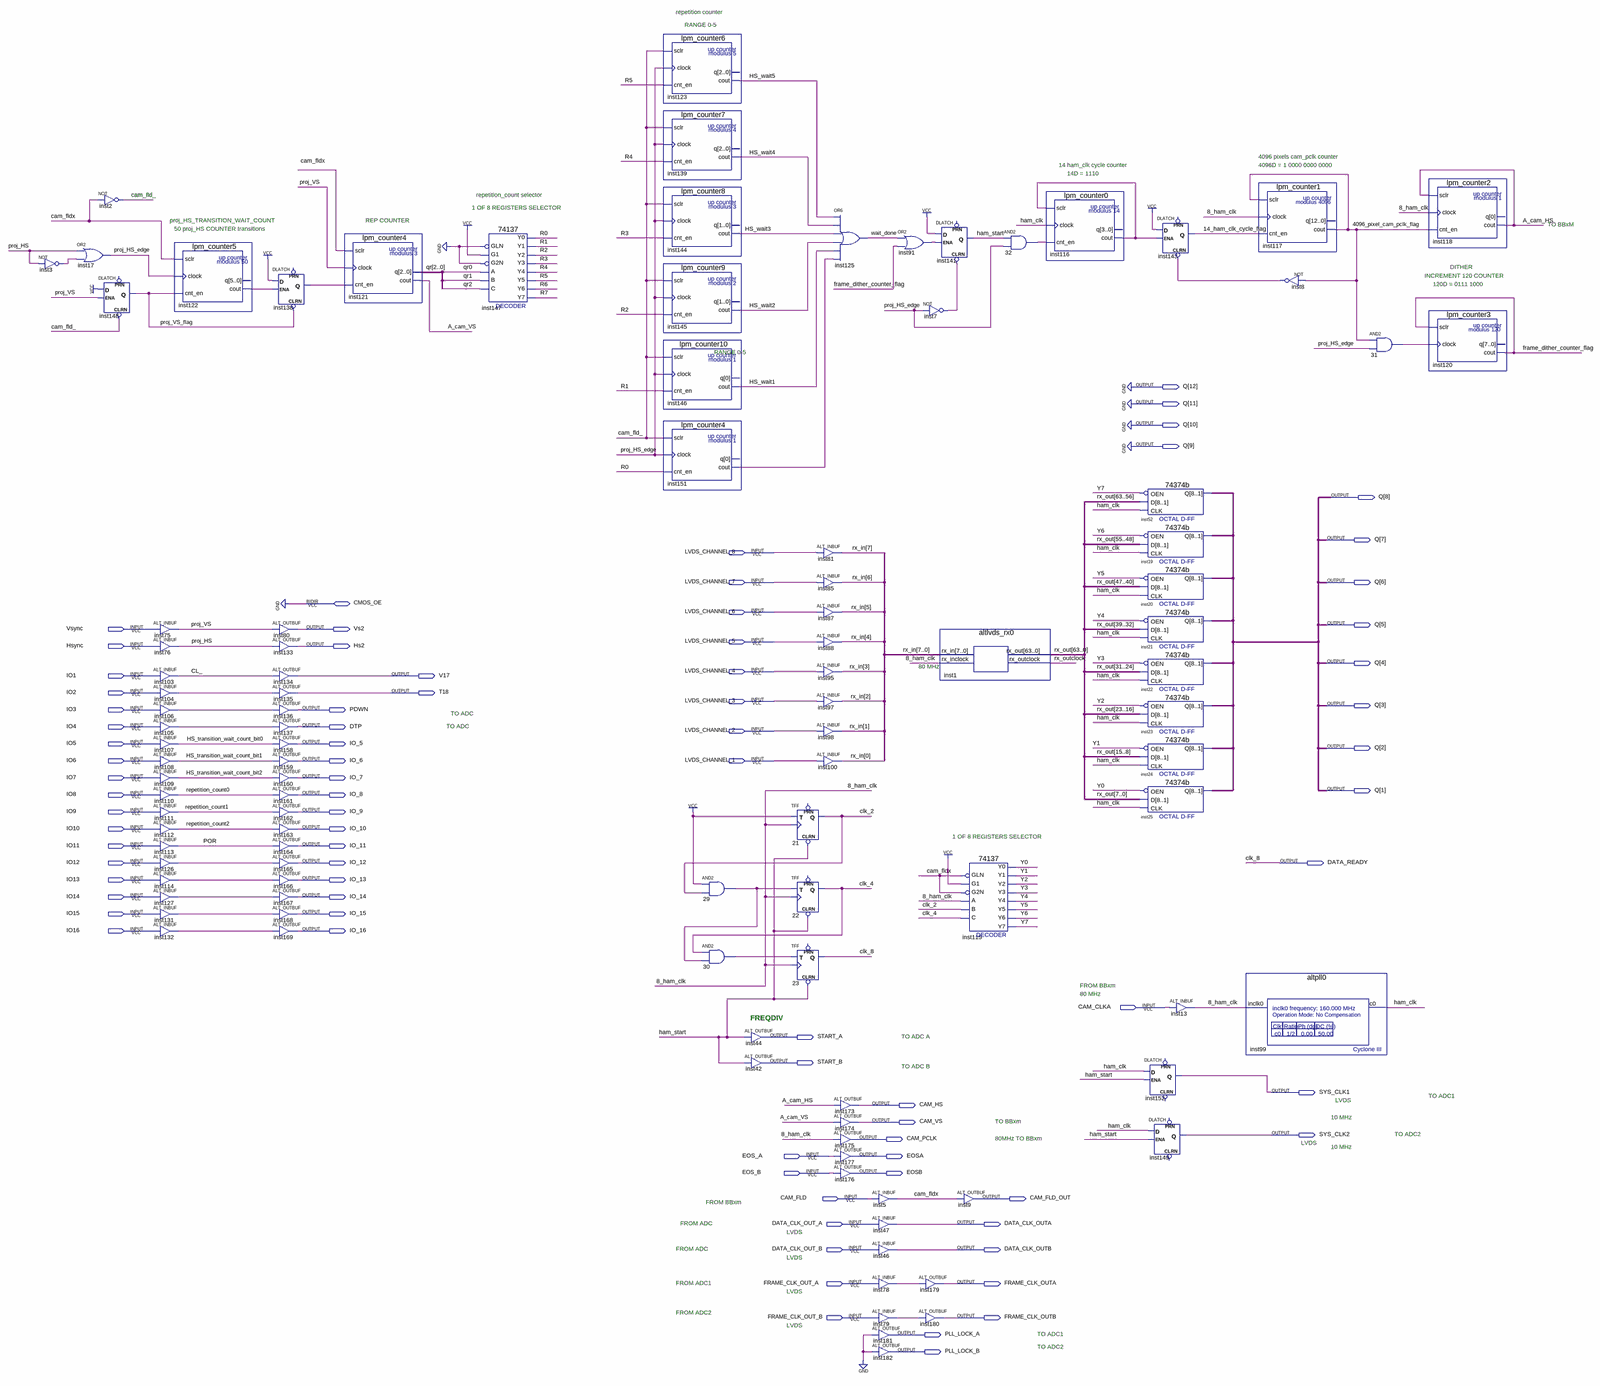
[diagram p0: schematic sheet, whole]
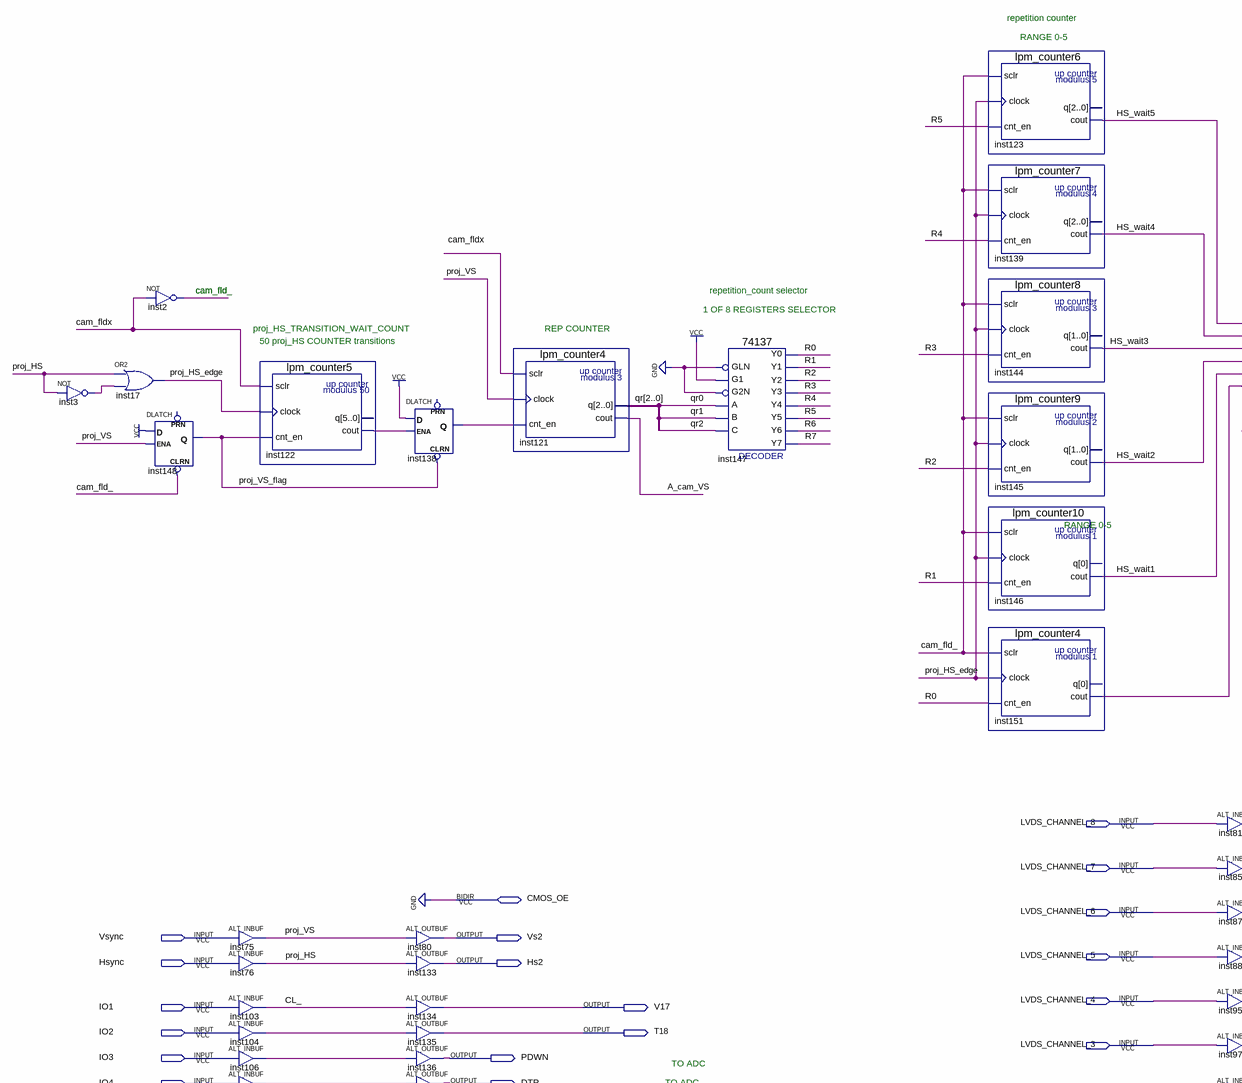
[diagram p1: schematic sheet, upper left part]
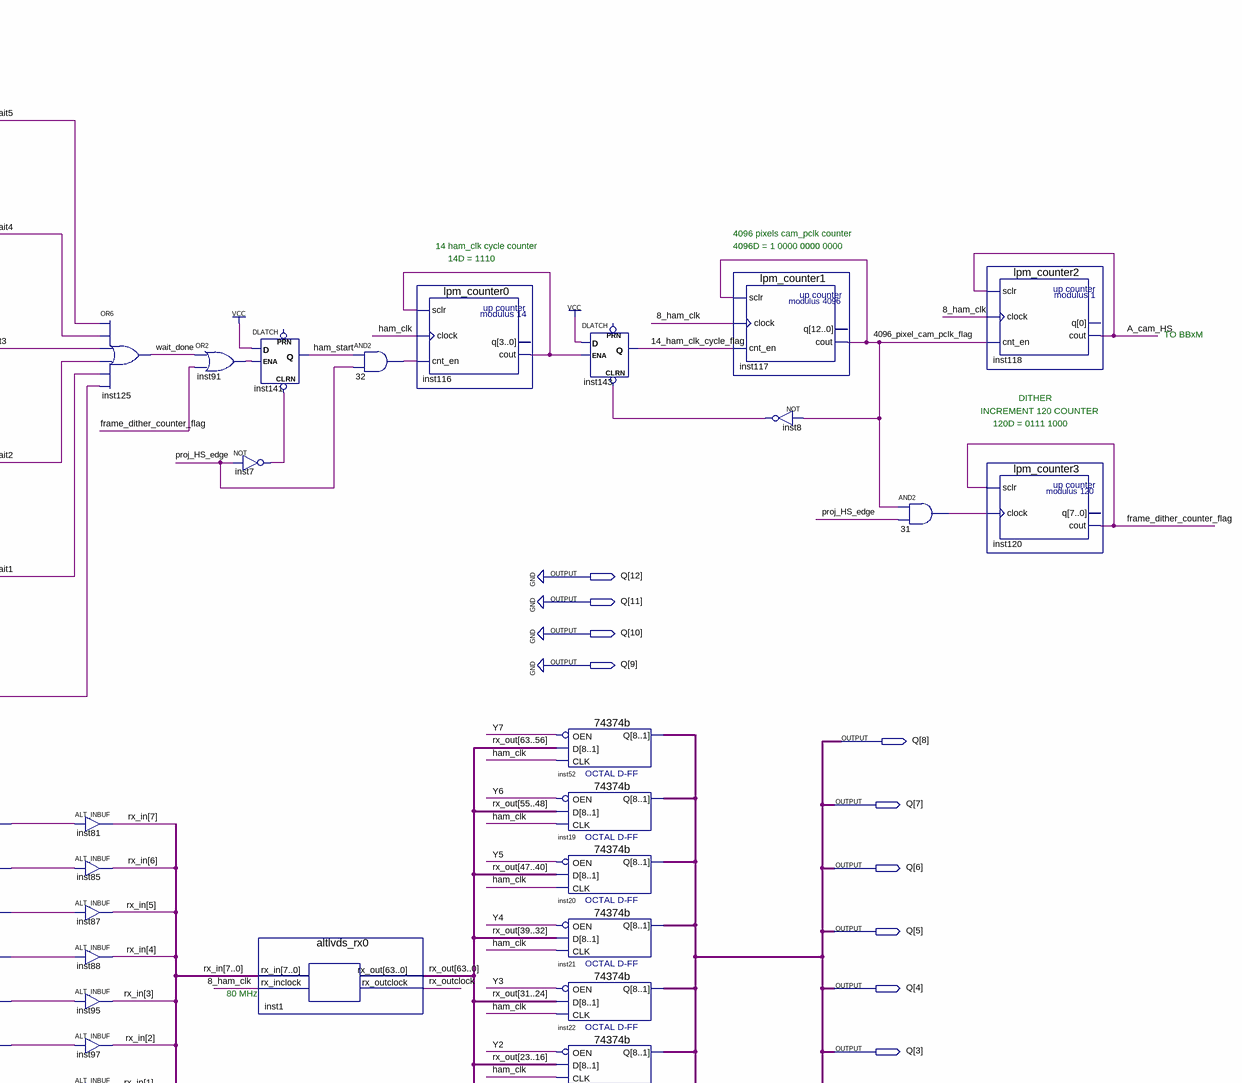
[diagram p2: schematic sheet, upper right part]
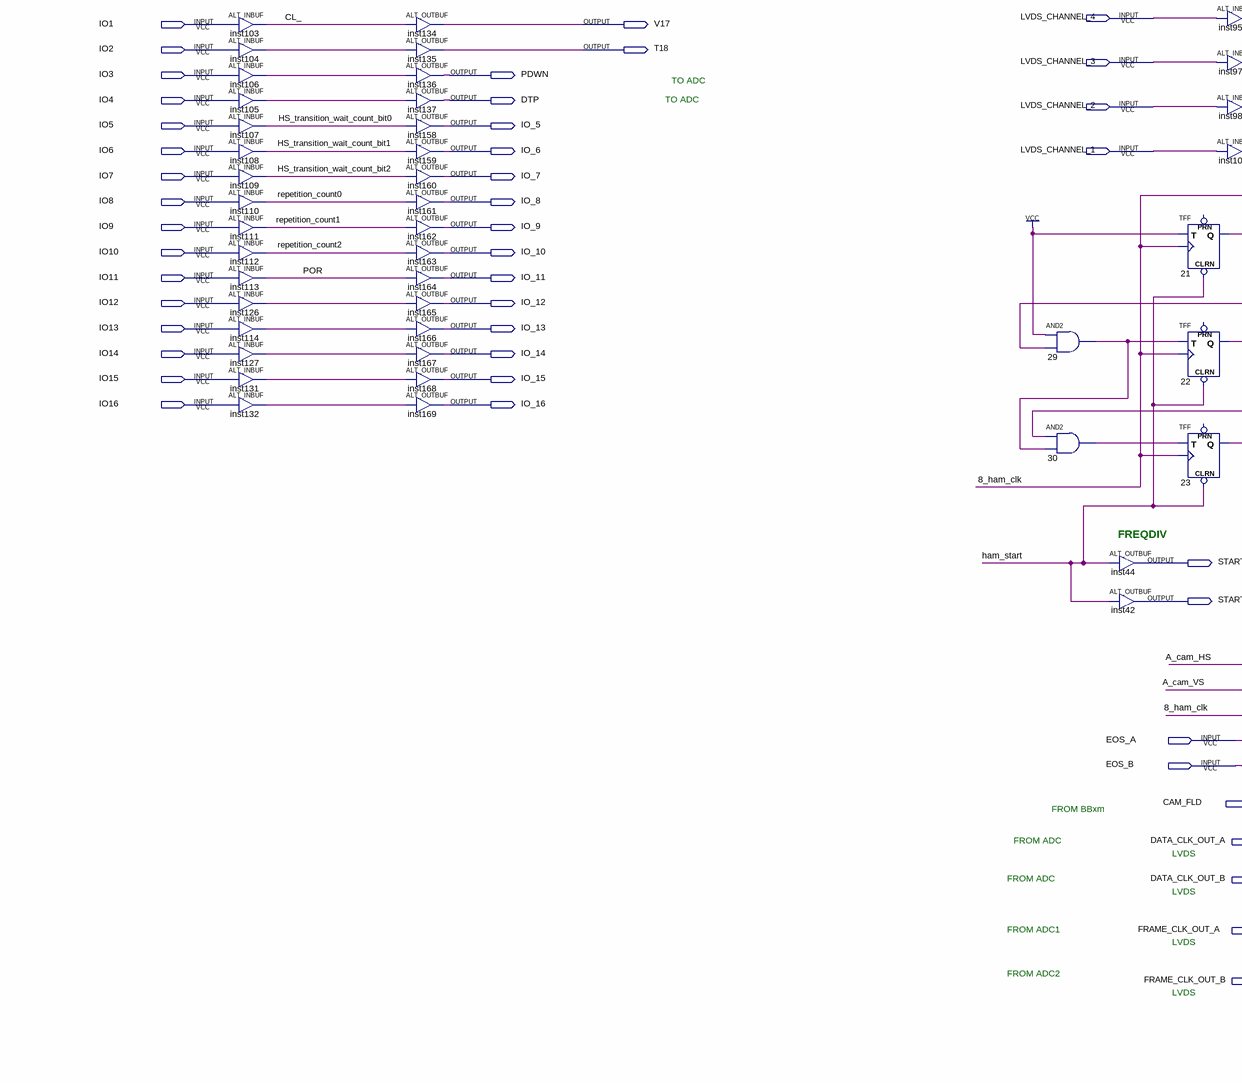
[diagram p3: schematic sheet, lower left part]
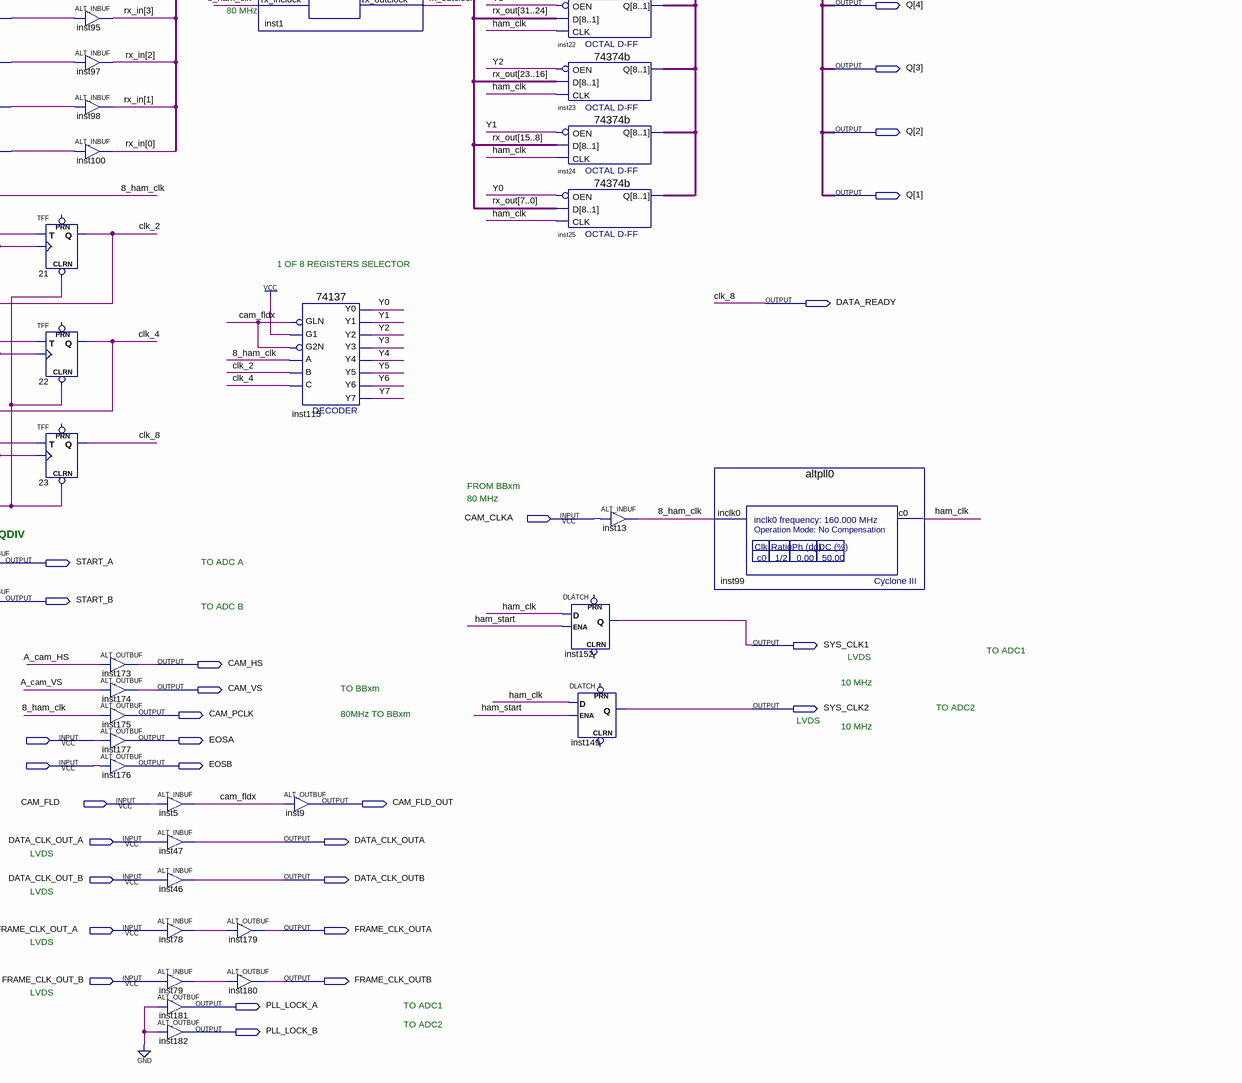
[diagram p4: schematic sheet, lower right part]
// Quartus schematic M2FS-Data-Formatter.bdf as structural Verilog: 106 symbols, 82 pins
module \M2FS-Data-Formatter  (
  input  LVDS_CHANNEL_8,
  input  LVDS_CHANNEL_7,
  input  LVDS_CHANNEL_6,
  input  Vsync,
  input  LVDS_CHANNEL_5,
  input  Hsync,
  input  LVDS_CHANNEL_4,
  input  IO1,
  input  IO2,
  input  LVDS_CHANNEL_3,
  input  IO3,
  input  IO4,
  input  LVDS_CHANNEL_2,
  input  IO5,
  input  IO6,
  input  LVDS_CHANNEL_1,
  input  IO7,
  input  IO8,
  input  IO9,
  input  IO10,
  input  IO11,
  input  IO12,
  input  IO13,
  input  IO14,
  input  IO15,
  input  IO16,
  input  CAM_CLKA,
  input  EOS_A,
  input  EOS_B,
  input  CAM_FLD,
  input  DATA_CLK_OUT_A,
  input  DATA_CLK_OUT_B,
  input  FRAME_CLK_OUT_A,
  input  FRAME_CLK_OUT_B,
  inout  CMOS_OE,
  output [12:1] Q,
  output Vs2,
  output Hs2,
  output V17,
  output T18,
  output PDWN,
  output DTP,
  output IO_5,
  output IO_6,
  output IO_7,
  output IO_8,
  output IO_9,
  output IO_10,
  output IO_11,
  output IO_12,
  output DATA_READY,
  output IO_13,
  output IO_14,
  output IO_15,
  output IO_16,
  output START_A,
  output START_B,
  output SYS_CLK1,
  output CAM_HS,
  output CAM_VS,
  output SYS_CLK2,
  output CAM_PCLK,
  output EOSA,
  output EOSB,
  output CAM_FLD_OUT,
  output DATA_CLK_OUTA,
  output DATA_CLK_OUTB,
  output FRAME_CLK_OUTA,
  output FRAME_CLK_OUTB,
  output PLL_LOCK_A,
  output PLL_LOCK_B
);

  wire \8_ham_clk , \14_ham_clk_cycle_flag , \4096_pixel_cam_pclk_flag , A_cam_HS, A_cam_VS, cam_fld_,
       cam_fldx, CL_, clk_2, clk_4, frame_dither_counter_flag, ham_clk, ham_start,
       HS_transition_wait_count_bit0, HS_transition_wait_count_bit1, HS_transition_wait_count_bit2, HS_wait1,
       HS_wait2, HS_wait3, HS_wait4, HS_wait5, inst3_out, inst7_out, inst8_out, inst78_o, inst79_o,
       inst91_out, inst104_o, inst105_o, inst106_o, inst114_o, inst116_cout, inst122_cout, inst126_o,
       inst127_o, inst131_o, inst132_o, inst138_q, inst151_cout, n29_out, n30_out, n31_out, n32_out, POR,
       proj_HS, proj_HS_edge, proj_VS, proj_VS_flag, R0, R1, R2, R3, R4, R5, R6, R7, repetition_count0,
       repetition_count1, repetition_count2, rx_outclock, wait_done, Y0, Y1, Y2, Y3, Y4, Y5, Y6, Y7;
  wire [2:0] qr;
  wire [7:0] inst52_q, rx_in;
  wire [63:0] rx_out;

  not inst3 (inst3_out, proj_HS);
  or inst17 (proj_HS_edge, proj_HS, inst3_out);
  not inst2 (cam_fld_, cam_fldx);
  DLATCH inst148 (.CLRN(cam_fld_), .D(1'b1), .ENA(proj_VS), .Q(proj_VS_flag));  // open: PRN
  lpm_counter5 inst122 (.sclr(cam_fldx), .clock(proj_HS_edge), .cnt_en(proj_VS_flag), .cout(inst122_cout));  // open: q
  ALT_INBUF inst75 (.i(Vsync), .o(proj_VS));
  ALT_INBUF inst76 (.i(Hsync), .o(proj_HS));
  ALT_INBUF inst103 (.i(IO1), .o(CL_));
  ALT_INBUF inst104 (.i(IO2), .o(inst104_o));
  ALT_INBUF inst106 (.i(IO3), .o(inst106_o));
  ALT_INBUF inst105 (.i(IO4), .o(inst105_o));
  ALT_INBUF inst107 (.i(IO5), .o(HS_transition_wait_count_bit0));
  ALT_INBUF inst108 (.i(IO6), .o(HS_transition_wait_count_bit1));
  ALT_INBUF inst109 (.i(IO7), .o(HS_transition_wait_count_bit2));
  ALT_INBUF inst110 (.i(IO8), .o(repetition_count0));
  ALT_INBUF inst111 (.i(IO9), .o(repetition_count1));
  ALT_INBUF inst112 (.i(IO10), .o(repetition_count2));
  ALT_INBUF inst113 (.i(IO11), .o(POR));
  ALT_INBUF inst126 (.i(IO12), .o(inst126_o));
  ALT_INBUF inst114 (.i(IO13), .o(inst114_o));
  ALT_INBUF inst127 (.i(IO14), .o(inst127_o));
  ALT_INBUF inst131 (.i(IO15), .o(inst131_o));
  ALT_INBUF inst132 (.i(IO16), .o(inst132_o));
  DLATCH inst138 (.CLRN(proj_VS_flag), .D(1'b1), .ENA(inst122_cout), .Q(inst138_q));  // open: PRN
  ALT_OUTBUF inst80 (.i(proj_VS), .o(Vs2));
  ALT_OUTBUF inst133 (.i(proj_HS), .o(Hs2));
  ALT_OUTBUF inst134 (.i(CL_), .o(V17));
  ALT_OUTBUF inst135 (.i(inst104_o), .o(T18));
  ALT_OUTBUF inst136 (.i(inst106_o), .o(PDWN));
  ALT_OUTBUF inst137 (.i(inst105_o), .o(DTP));
  ALT_OUTBUF inst158 (.i(HS_transition_wait_count_bit0), .o(IO_5));
  ALT_OUTBUF inst159 (.i(HS_transition_wait_count_bit1), .o(IO_6));
  ALT_OUTBUF inst160 (.i(HS_transition_wait_count_bit2), .o(IO_7));
  ALT_OUTBUF inst161 (.i(repetition_count0), .o(IO_8));
  ALT_OUTBUF inst162 (.i(repetition_count1), .o(IO_9));
  ALT_OUTBUF inst163 (.i(repetition_count2), .o(IO_10));
  ALT_OUTBUF inst164 (.i(POR), .o(IO_11));
  ALT_OUTBUF inst165 (.i(inst126_o), .o(IO_12));
  ALT_OUTBUF inst166 (.i(inst114_o), .o(IO_13));
  ALT_OUTBUF inst167 (.i(inst127_o), .o(IO_14));
  ALT_OUTBUF inst168 (.i(inst131_o), .o(IO_15));
  ALT_OUTBUF inst169 (.i(inst132_o), .o(IO_16));
  lpm_counter4 inst121 (.sclr(cam_fldx), .clock(proj_VS), .cnt_en(inst138_q), .cout(A_cam_VS), .q(qr));
  \74137  inst147 (
    .GLN(1'b0), .G1(1'b1), .A(qr[0]), .G2N(1'b0), .B(qr[1]), .C(qr[2]), .Y0(R0), .Y1(R1), .Y2(R2), .Y5(R5),
    .Y4(R4), .Y3(R3), .Y6(R6), .Y7(R7));
  lpm_counter6 inst123 (.sclr(cam_fld_), .clock(proj_HS_edge), .cnt_en(R5), .cout(HS_wait5));  // open: q
  lpm_counter7 inst139 (.sclr(cam_fld_), .clock(proj_HS_edge), .cnt_en(R4), .cout(HS_wait4));  // open: q
  lpm_counter8 inst144 (.sclr(cam_fld_), .clock(proj_HS_edge), .cnt_en(R3), .cout(HS_wait3));  // open: q
  lpm_counter9 inst145 (.sclr(cam_fld_), .clock(proj_HS_edge), .cnt_en(R2), .cout(HS_wait2));  // open: q
  lpm_counter10 inst146 (.sclr(cam_fld_), .clock(proj_HS_edge), .cnt_en(R1), .cout(HS_wait1));  // open: q
  lpm_counter4 inst151 (.sclr(cam_fld_), .clock(proj_HS_edge), .cnt_en(R0), .cout(inst151_cout));  // open: q
  and u_29 (n29_out, 1'b1, clk_2);
  and u_30 (n30_out, clk_4, n29_out);
  ALT_OUTBUF inst44 (.i(ham_start), .o(START_A));
  ALT_OUTBUF inst42 (.i(ham_start), .o(START_B));
  TFF u_21 (.CLRN(ham_start), .T(1'b1), .CLK(\8_ham_clk ), .Q(clk_2));  // open: PRN
  TFF u_22 (.CLRN(ham_start), .T(n29_out), .CLK(\8_ham_clk ), .Q(clk_4));  // open: PRN
  TFF u_23 (.CLRN(ham_start), .T(n30_out), .CLK(\8_ham_clk ), .Q(DATA_READY));  // open: PRN
  ALT_INBUF inst81 (.i(LVDS_CHANNEL_8), .o(rx_in[7]));
  ALT_INBUF inst85 (.i(LVDS_CHANNEL_7), .o(rx_in[6]));
  ALT_INBUF inst87 (.i(LVDS_CHANNEL_6), .o(rx_in[5]));
  ALT_INBUF inst88 (.i(LVDS_CHANNEL_5), .o(rx_in[4]));
  ALT_INBUF inst95 (.i(LVDS_CHANNEL_4), .o(rx_in[3]));
  ALT_INBUF inst97 (.i(LVDS_CHANNEL_3), .o(rx_in[2]));
  ALT_INBUF inst98 (.i(LVDS_CHANNEL_2), .o(rx_in[1]));
  ALT_INBUF inst100 (.i(LVDS_CHANNEL_1), .o(rx_in[0]));
  or inst125 (wait_done, HS_wait5, HS_wait4, HS_wait3, HS_wait2, HS_wait1, inst151_cout);
  ALT_OUTBUF inst173 (.i(A_cam_HS), .o(CAM_HS));
  ALT_OUTBUF inst174 (.i(A_cam_VS), .o(CAM_VS));
  ALT_OUTBUF inst175 (.i(\8_ham_clk ), .o(CAM_PCLK));
  ALT_OUTBUF inst177 (.i(EOS_A), .o(EOSA));
  ALT_OUTBUF inst176 (.i(EOS_B), .o(EOSB));
  or inst91 (inst91_out, wait_done, frame_dither_counter_flag);
  ALT_INBUF inst5 (.i(CAM_FLD), .o(cam_fldx));
  ALT_INBUF inst47 (.i(DATA_CLK_OUT_A), .o(DATA_CLK_OUTA));
  ALT_INBUF inst46 (.i(DATA_CLK_OUT_B), .o(DATA_CLK_OUTB));
  ALT_INBUF inst78 (.i(FRAME_CLK_OUT_A), .o(inst78_o));
  ALT_INBUF inst79 (.i(FRAME_CLK_OUT_B), .o(inst79_o));
  ALT_OUTBUF inst181 (.i(1'b0), .o(PLL_LOCK_A));
  ALT_OUTBUF inst182 (.i(1'b0), .o(PLL_LOCK_B));
  not inst7 (inst7_out, proj_HS_edge);
  ALT_OUTBUF inst179 (.i(inst78_o), .o(FRAME_CLK_OUTA));
  ALT_OUTBUF inst180 (.i(inst79_o), .o(FRAME_CLK_OUTB));
  DLATCH inst141 (.CLRN(inst7_out), .D(1'b1), .ENA(inst91_out), .Q(ham_start));  // open: PRN
  altlvds_rx0 inst1 (.rx_in(rx_in), .rx_inclock(\8_ham_clk ), .rx_out(rx_out), .rx_outclock(rx_outclock));
  \74137  inst115 (
    .GLN(cam_fldx), .G1(1'b1), .A(\8_ham_clk ), .G2N(cam_fldx), .B(clk_2), .C(clk_4), .Y0(Y0), .Y1(Y1),
    .Y2(Y2), .Y5(Y5), .Y4(Y4), .Y3(Y3), .Y6(Y6), .Y7(Y7));
  ALT_OUTBUF inst9 (.i(cam_fldx), .o(CAM_FLD_OUT));
  and u_32 (n32_out, ham_start, proj_HS_edge);
  lpm_counter0 inst116 (.sclr(inst116_cout), .clock(ham_clk), .cnt_en(n32_out), .cout(inst116_cout));  // open: q
  DLATCH inst143 (.CLRN(inst8_out), .D(1'b1), .ENA(inst116_cout), .Q(\14_ham_clk_cycle_flag ));  // open: PRN
  \74374b  inst52 (.D(rx_out[63:56]), .OEN(Y7), .CLK(ham_clk), .Q(inst52_q));
  \74374b  inst19 (.D(rx_out[55:48]), .OEN(Y6), .CLK(ham_clk), .Q(inst52_q));
  \74374b  inst20 (.D(rx_out[47:40]), .OEN(Y5), .CLK(ham_clk), .Q(inst52_q));
  \74374b  inst21 (.D(rx_out[39:32]), .OEN(Y4), .CLK(ham_clk), .Q(inst52_q));
  \74374b  inst22 (.D(rx_out[31:24]), .OEN(Y3), .CLK(ham_clk), .Q(inst52_q));
  \74374b  inst23 (.D(rx_out[23:16]), .OEN(Y2), .CLK(ham_clk), .Q(inst52_q));
  \74374b  inst24 (.D(rx_out[15:8]), .OEN(Y1), .CLK(ham_clk), .Q(inst52_q));
  \74374b  inst25 (.D(rx_out[7:0]), .OEN(Y0), .CLK(ham_clk), .Q(inst52_q));
  ALT_INBUF inst13 (.i(CAM_CLKA), .o(\8_ham_clk ));
  DLATCH inst152 (.D(ham_clk), .ENA(ham_start), .Q(SYS_CLK1));  // open: CLRN, PRN
  DLATCH inst149 (.D(ham_clk), .ENA(ham_start), .Q(SYS_CLK2));  // open: CLRN, PRN
  lpm_counter1 inst117 (
    .sclr(\4096_pixel_cam_pclk_flag ), .clock(\8_ham_clk ), .cnt_en(\14_ham_clk_cycle_flag ),
    .cout(\4096_pixel_cam_pclk_flag ));  // open: q
  altpll0 inst99 (.inclk0(\8_ham_clk ), .c0(ham_clk));
  not inst8 (inst8_out, \4096_pixel_cam_pclk_flag );
  and u_31 (n31_out, \4096_pixel_cam_pclk_flag , proj_HS_edge);
  lpm_counter2 inst118 (
    .sclr(A_cam_HS), .clock(\8_ham_clk ), .cnt_en(\4096_pixel_cam_pclk_flag ), .cout(A_cam_HS));  // open: q
  lpm_counter3 inst120 (
    .sclr(frame_dither_counter_flag), .clock(n31_out), .cout(frame_dither_counter_flag));  // open: q

  assign Q[12:9] = 4'b0000;
  // also tied to GND on the sheet: CMOS_OE

  // Other names for the same wires on the sheet: clk_8 = DATA_READY

  // Notes on the sheet:
  //   repetition counter
  //   RANGE 0-5
  //   4096 pixels cam_pclk counter
  //   14 ham_clk cycle counter
  //   4096D = 1 0000 0000 0000 
  //   14D = 1110
  //   cam_fld_
  //   repetition_count selector
  //   1 OF 8 REGISTERS SELECTOR
  //   proj_HS_TRANSITION_WAIT_COUNT
  //   REP COUNTER
  //   TO BBxM
  //   50 proj_HS COUNTER transitions
  //   DITHER
  //   INCREMENT 120 COUNTER
  //   120D = 0111 1000
  //   RANGE 0-5
  //   80 MHz
  //   TO ADC
  //   TO ADC
  //   1 OF 8 REGISTERS SELECTOR
  //   FROM BBxm
  //   80 MHz
  //   FREQDIV
  //   TO ADC A
  //   TO ADC B
  //   TO ADC1
  //   LVDS
  //   10 MHz
  //   TO BBxm
  //   TO ADC2
  //   80MHz TO BBxm
  //   LVDS
  //   10 MHz
  //   FROM BBxm
  //   FROM ADC
  //   LVDS
  //   FROM ADC
  //   LVDS
  //   FROM ADC1
  //   LVDS
  //   FROM ADC2
  //   LVDS
  //   TO ADC1
  //   TO ADC2
endmodule
